# Altium schematic sheet I2C extender 1.SchDoc
size A4; SheetNumber: 5; SheetTotal: 6
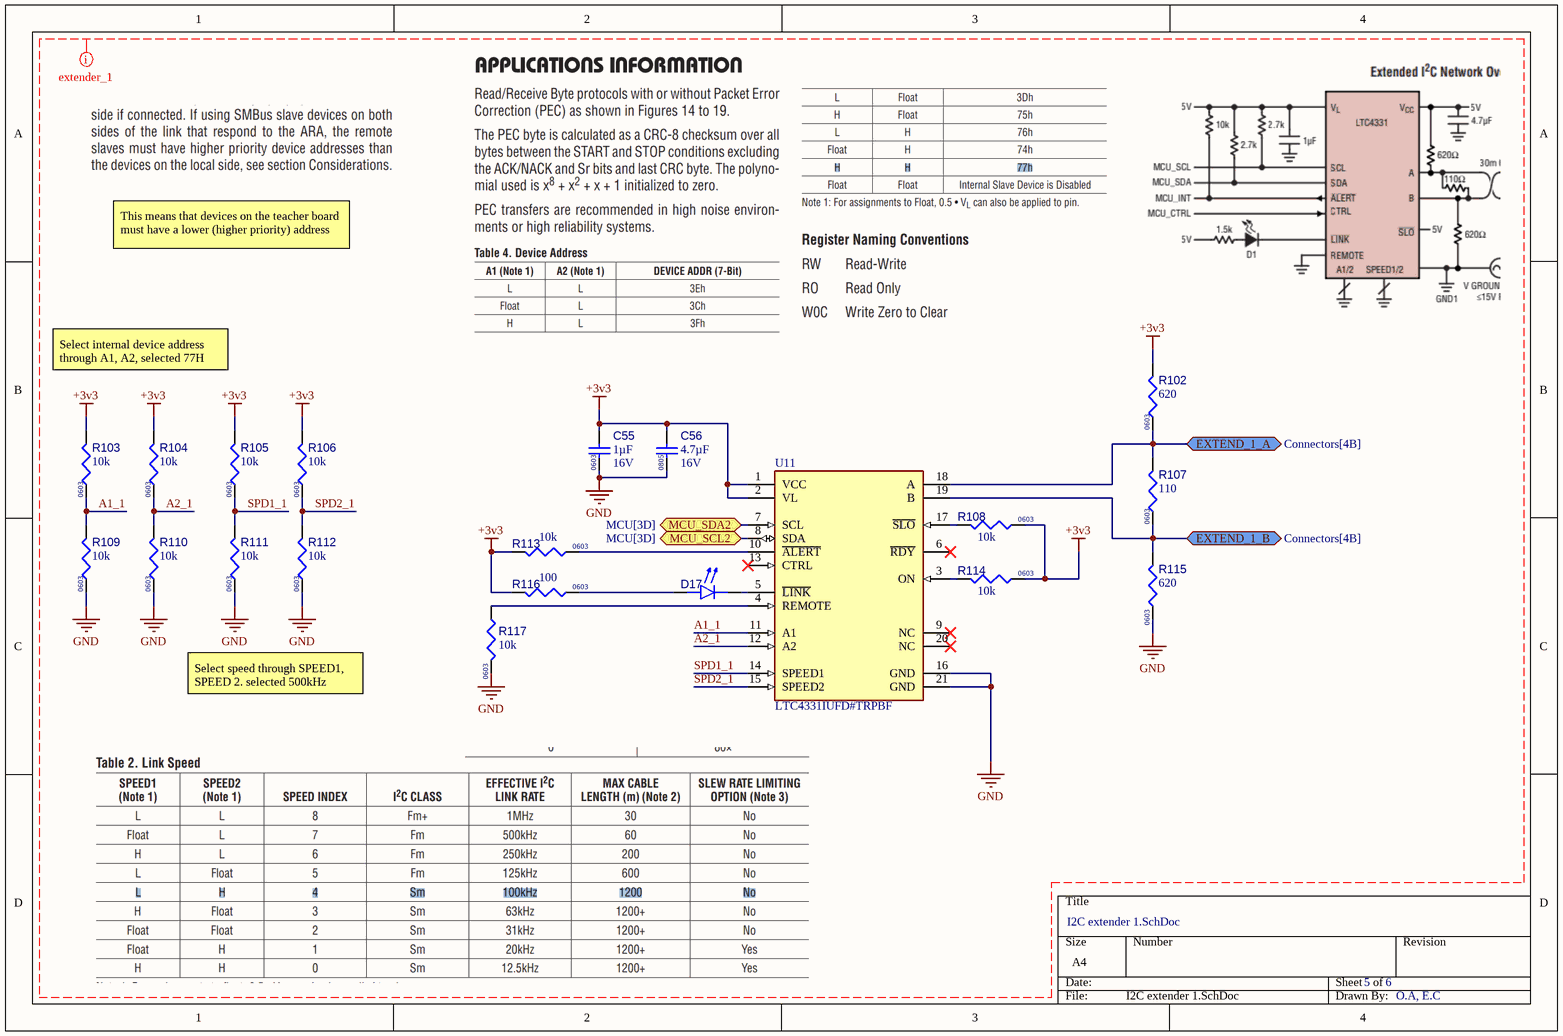
[diagram p0: I2C extender 1.SchDoc]

## Parts
C55  value 1µF  Case/Package: 0603  Voltage Rating: 16V  [CAPC1608X90X35NL15T15]  (hidden comment: Capacitor 1uF +/- 10% 16V 0603)
C56  value 4.7µF  Case/Package: 0805  Rated DC Voltage (URdc): 16V  [CL21A475KOFNNNE-Footprint-1]  (hidden comment: CL21A475KOFNNNE)
D17  150060YS75000  [WL-SMCW_0603_150060xx75000]  (value not drawn)
R102  value 620  Case/Package: 0603  [RC0603JR-0720KL-Footprint-1]  (hidden comment: RC0603FR-07620RL)
R103  value 10k  Case/Package: 0603  [RESC1608X55X25NL10T15]  (hidden comment: Resistor 10k +/-1% 0603 100 mW)
R104  value 10k  Case/Package: 0603  [RESC1608X55X25NL10T15]  (hidden comment: Resistor 10k +/-1% 0603 100 mW)
R105  value 10k  Case/Package: 0603  [RESC1608X55X25NL10T15]  (hidden comment: Resistor 10k +/-1% 0603 100 mW)
R106  value 10k  Case/Package: 0603  [RESC1608X55X25NL10T15]  (hidden comment: Resistor 10k +/-1% 0603 100 mW)
R107  value 110  Case/Package: 0603  [RC0603JR-0720KL-Footprint-1]  (hidden comment: RC0603FR-07110RL)
R108  value 10k  Case/Package: 0603  [RESC1608X55X25NL10T15]  (hidden comment: Resistor 10k +/-1% 0603 100 mW)
R109  value 10k  Case/Package: 0603  [RESC1608X55X25NL10T15]  (hidden comment: Resistor 10k +/-1% 0603 100 mW)
R110  value 10k  Case/Package: 0603  [RESC1608X55X25NL10T15]  (hidden comment: Resistor 10k +/-1% 0603 100 mW)
R111  value 10k  Case/Package: 0603  [RESC1608X55X25NL10T15]  (hidden comment: Resistor 10k +/-1% 0603 100 mW)
R112  value 10k  Case/Package: 0603  [RESC1608X55X25NL10T15]  (hidden comment: Resistor 10k +/-1% 0603 100 mW)
R113  value 10k  Case/Package: 0603  [RESC1608X55X25NL10T15]  (hidden comment: Resistor 10k +/-1% 0603 100 mW)
R114  value 10k  Case/Package: 0603  [RESC1608X55X25NL10T15]  (hidden comment: Resistor 10k +/-1% 0603 100 mW)
R115  value 620  Case/Package: 0603  [RC0603JR-0720KL-Footprint-1]  (hidden comment: RC0603FR-07620RL)
R116  value 100  Case/Package: 0603  [RC0603JR-0720KL-Footprint-1]  (hidden comment: RC0603FR-07100RL)
R117  value 10k  Case/Package: 0603  [RESC1608X55X25NL10T15]  (hidden comment: Resistor 10k +/-1% 0603 100 mW)
U11  LTC4331IUFD#TRPBF  [FP-UFD-20-05-08-1711-IPC_C]

## Ports
EXTEND_1_A (bidir, see Connectors[4B]), EXTEND_1_B (bidir, see Connectors[4B]), MCU_SCL2 (bidir, see MCU[3D]), MCU_SDA2 (bidir, see MCU[3D])

## Nets
+3v3: C55.2 C56.2 R102.2 R103.2 R104.2 R105.2 R106.2 R108.1 R113.1 R114.1 R116.2 U11.1(VCC) U11.2(VL)
GND: C55.1 C56.1 R109.1 R110.1 R111.1 R112.1 R115.1 R117.1 U11.16(GND) U11.21(GND)
A1_1: R103.1 R109.2 U11.11(A1)
A2_1: R104.1 R110.2 U11.12(A2)
EXTEND_1_A: R102.1 R107.2 U11.18(A) ; port EXTEND_1_A
EXTEND_1_B: R107.1 R115.2 U11.19(B) ; port EXTEND_1_B
MCU_SCL2: U11.8(SDA) ; port MCU_SCL2
MCU_SDA2: U11.7(SCL) ; port MCU_SDA2
SPD1_1: R105.1 R111.2 U11.14(SPEED1)
SPD2_1: R106.1 R112.2 U11.15(SPEED2)
NetD17_1: D17.1(K) U11.5(~{LINK})
NetD17_2: D17.2(A) R116.1
NetR108_2: R108.2 U11.17(~{SLO})
NetR113_2: R113.2 U11.10(~{ALERT})
NetR114_2: R114.2 U11.3(ON)
NetR117_2: R117.2 U11.4(REMOTE)

Not connected (* = marked no-connect by the designer): U11 6(~{RDY})* 9(NC)* 13(CTRL)* 20(NC)*

## Layout directives
mark named extender_1: +3v3, A1_1, A2_1, GND, SPD1_1, SPD2_1

## Notes on the sheet
- This means that devices on the teacher board must have a lower (higher priority) address
- Select internal device address through A1, A2, selected 77H
- Select speed through SPEED1, SPEED 2. selected 500kHz
- O.A, E.C

## Library data of the parts
C55 = CMP-001-00004-8: Chip Capacitor, 1 uF, +/- 10%, 16 V, 0603 (1608 Metric); Capacitor Type: Ceramic; Mounting Technology: SM; RoHS Compliant: True; Min Operating Temperature: -55°C; Pins: 2; Max Operating Temperature: 125°C; Tolerance: 10%
C56 = CMP-001-00089-2: Ceramic Capacitor, Multilayer, Ceramic, 16V, 10% +Tol, 10% -Tol, X5R, 15% TC, 4.7uF, Surface Mount, 0805; Multilayer: Yes; Dielectric Material: Ceramic; Tolerance (fill in as +-): 10%; Pins: 2; Package Style: SMTMeter; Max Operating Temperature: 85°C; JESD-609 Code: e3; Termination: Wraparound; Min Operating Temperature: -55°C; RoHS Compliant: Yes; Mounting Technology: Surface Mount; Reach SVHC Compliant: Yes; Terminal Finish: Nickel; Packaging: Tape and Reel; Capacitor Type: Ceramic; Height: 1.35mm; Width: 1.25mm; Temperature Characteristics Code: X5R; Length: 2mm; Tolerance  (fill in as +-): 10%; Package Shape: Rectangular
D17 = CMP-007-00046-1: Single Color LED, Yellow, Water Clear, 1.1mm; Shape: Rectangular; Forward Current: 30mA; Forward Voltage: 2V; Viewing Angle: 140°; Channels: 1; Luminous Intensity-Nom: 120mcd; Overall Height: 0.7mm; Packaging: Tape and Reel; Size: 1.1mm; Max Operating Temperature: 85°C; RoHS Compliant: Yes; Color: Yellow; Pins: 2; Lens Style: WATER CLEAR; Reach SVHC Compliant: Yes; Terminal Pitch: 1.6mm; Mounting Technology: Surface Mount; Min Operating Temperature: -40°C; Optoelectronic Device Type: SINGLE COLOR LED
R102 R115 = CMP-009-00191-1: Fixed Resistor, Metal Glaze/thick Film, 0.1W, 620ohm, 75V, 1% +/-Tol, 100ppm/Cel, Surface Mount, 0603; Power: 100mW; Additional Feature: LASER TRIMMABLE; Package Height: 0.45mm; Package Width: 0.8mm; Temperature Coefficient: 100ppm/°C; Rated Temperature: 70°C; Package Length: 1.6mm; Package Shape: Rectangular; Min Operating Temperature: -55°C; Technology: METAL GLAZE/THICK FILM; Reach SVHC Compliant: Yes; Pins: 2; Working Voltage: 75V; Tolerance: 1%; Terminal Finish: Nickel; RoHS Compliant: Yes; Termination: Wraparound; Construction: Chip; JESD-609 Code: e3; Mounting Technology: Surface Mount; Max Operating Temperature: 155°C; Package Style: SMTMeter; Packaging: Tape and Reel; Resistor Type: FIXED RESISTOR
R103-R106 R108-R114 R117 = CMP-009-00017-7: Chip Resistor, 10 KOhm, +/- 1%, 01 W, -55 to 155 degC, 0603 (1608 Metric); Voltage Rating: 50V; Power: 100mW; RoHS Compliant: True; Min Operating Temperature: -55°C; Pins: 2; Mounting Technology: SM; Max Operating Temperature: 155°C; Tolerance: 1%
R107 = CMP-009-00190-1: Fixed Resistor, Metal Glaze/thick Film, 0.1W, 110ohm, 75V, 1% +/-Tol, 100ppm/Cel, Surface Mount, 0603; Package Length: 1.6mm; Temperature Coefficient: 100ppm/°C; Power: 100mW; Package Height: 0.45mm; Package Width: 0.8mm; Additional Feature: LASER TRIMMABLE; Rated Temperature: 70°C; Termination: Wraparound; JESD-609 Code: e3; RoHS Compliant: Yes; Tolerance: 1%; Max Operating Temperature: 155°C; Package Style: SMTMeter; Terminal Finish: Nickel; Packaging: Tape and Reel; Package Shape: Rectangular; Pins: 2; Working Voltage: 75V; Construction: Chip; Resistor Type: FIXED RESISTOR; Technology: METAL GLAZE/THICK FILM; Reach SVHC Compliant: Yes; Mounting Technology: Surface Mount; Min Operating Temperature: -55°C
R116 = CMP-009-00189-1: Fixed Resistor, Metal Glaze/thick Film, 0.1W, 100ohm, 75V, 1% +/-Tol, 100ppm/Cel, Surface Mount, 0603; Rated Temperature: 70°C; Package Width: 0.8mm; Package Length: 1.6mm; Package Height: 0.45mm; Additional Feature: LASER TRIMMABLE; Temperature Coefficient: 100ppm/°C; Power: 100mW; Package Shape: Rectangular; Tolerance: 1%; JESD-609 Code: e3; Resistor Type: FIXED RESISTOR; Terminal Finish: Nickel; Max Operating Temperature: 155°C; Reach SVHC Compliant: Yes; Technology: METAL GLAZE/THICK FILM; Mounting Technology: Surface Mount; RoHS Compliant: Yes; Construction: Chip; Packaging: Tape and Reel; Package Style: SMTMeter; Termination: Wraparound; Working Voltage: 75V; Min Operating Temperature: -55°C; Pins: 2
U11 = CMP-015-00011-1: Interface Circuit, CMOS, PQCC20; Throw Configuration: POWER SUPPLY SUPPORT CIRCUIT; Reach SVHC Compliant: Yes; RoHS Compliant: Yes